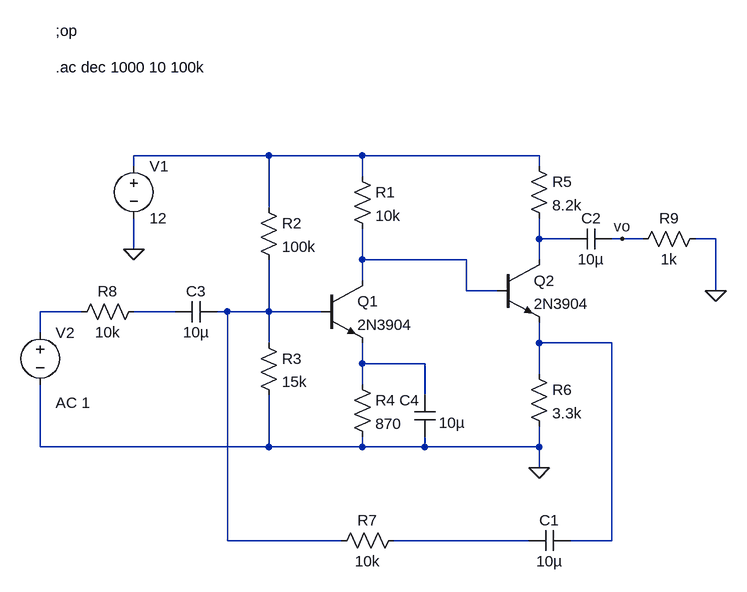
[diagram p0: schematic realimentacion1.asc]
realimentacion1.asc, the LTspice schematic file:
Version 4
SHEET 1 880 708
WIRE -144 16 -352 16
WIRE 0 16 -144 16
WIRE 272 16 0 16
WIRE -352 32 -352 16
WIRE 272 32 272 16
WIRE 0 48 0 16
WIRE -144 96 -144 16
WIRE 272 144 272 112
WIRE 320 144 272 144
WIRE 400 144 384 144
WIRE 432 144 400 144
WIRE 544 144 512 144
WIRE -352 160 -352 112
WIRE 0 176 0 128
WIRE 80 176 0 176
WIRE 160 176 80 176
WIRE 272 176 272 144
WIRE 0 208 0 176
WIRE 160 224 160 176
WIRE 208 224 160 224
WIRE 544 224 544 144
WIRE -432 256 -496 256
WIRE -288 256 -352 256
WIRE -208 256 -224 256
WIRE -144 256 -144 176
WIRE -144 256 -208 256
WIRE -96 256 -144 256
WIRE -64 256 -96 256
WIRE -496 288 -496 256
WIRE -144 304 -144 256
WIRE 272 304 272 272
WIRE 304 304 272 304
WIRE 384 304 304 304
WIRE 0 336 0 304
WIRE 48 336 0 336
WIRE 96 336 48 336
WIRE 272 352 272 304
WIRE 0 368 0 336
WIRE 96 384 96 336
WIRE -496 464 -496 368
WIRE -144 464 -144 384
WIRE -144 464 -496 464
WIRE 0 464 0 448
WIRE 0 464 -144 464
WIRE 96 464 96 448
WIRE 96 464 0 464
WIRE 272 464 272 432
WIRE 272 464 96 464
WIRE 272 496 272 464
WIRE -208 608 -208 256
WIRE -32 608 -208 608
WIRE 256 608 48 608
WIRE 384 608 384 304
WIRE 384 608 320 608
FLAG -352 160 0
FLAG 544 224 0
FLAG 272 496 0
FLAG 400 144 vo
DATAFLAG 272 144 ""
DATAFLAG 304 304 ""
DATAFLAG 80 176 ""
DATAFLAG 48 336 ""
DATAFLAG -96 256 ""
SYMBOL voltage -352 16 R0
WINDOW 123 0 0 Left 2
WINDOW 39 0 0 Left 2
SYMATTR InstName V1
SYMATTR Value 12
SYMBOL npn -64 208 R0
SYMATTR InstName Q1
SYMATTR Value 2N3904
SYMBOL npn 208 176 R0
SYMATTR InstName Q2
SYMATTR Value 2N3904
SYMBOL res -16 32 R0
SYMATTR InstName R1
SYMATTR Value 10k
SYMBOL res -160 80 R0
SYMATTR InstName R2
SYMATTR Value 100k
SYMBOL res -160 288 R0
SYMATTR InstName R3
SYMATTR Value 15k
SYMBOL res -16 352 R0
SYMATTR InstName R4
SYMATTR Value 870
SYMBOL res 256 16 R0
SYMATTR InstName R5
SYMATTR Value 8.2k
SYMBOL res 256 336 R0
SYMATTR InstName R6
SYMATTR Value 3.3k
SYMBOL res 64 592 R90
WINDOW 0 0 56 VBottom 2
WINDOW 3 32 56 VTop 2
SYMATTR InstName R7
SYMATTR Value 10k
SYMBOL res -336 240 R90
WINDOW 0 0 56 VBottom 2
WINDOW 3 32 56 VTop 2
SYMATTR InstName R8
SYMATTR Value 10k
SYMBOL res 528 128 R90
WINDOW 0 0 56 VBottom 2
WINDOW 3 32 56 VTop 2
SYMATTR InstName R9
SYMATTR Value 1k
SYMBOL cap 320 592 R90
WINDOW 0 0 32 VBottom 2
WINDOW 3 32 32 VTop 2
SYMATTR InstName C1
SYMATTR Value 10µ
SYMBOL cap 384 128 R90
WINDOW 0 0 32 VBottom 2
WINDOW 3 32 32 VTop 2
SYMATTR InstName C2
SYMATTR Value 10µ
SYMBOL cap -224 240 R90
WINDOW 0 0 32 VBottom 2
WINDOW 3 32 32 VTop 2
SYMATTR InstName C3
SYMATTR Value 10µ
SYMBOL cap 112 448 R180
WINDOW 0 24 56 Left 2
WINDOW 3 -46 21 Left 2
SYMATTR InstName C4
SYMATTR Value 10µ
SYMBOL voltage -496 272 R0
WINDOW 123 24 124 Left 2
WINDOW 39 0 0 Left 2
SYMATTR Value2 AC 1
SYMATTR InstName V2
SYMATTR Value ""
TEXT -472 -176 Left 2 !;op
TEXT -472 -120 Left 2 !.ac dec 1000 10 100k

The netlist it stands for:
* realimentacion1.asc
V1 N001 0 12
Q1 N003 N006 N008 0 2N3904
Q2 N002 N003 N007 0 2N3904
R1 N001 N003 10k
R2 N001 N006 100k
R3 N006 0 15k
R4 N008 0 870
R5 N001 N002 8.2k
R6 N007 0 3.3k
R7 N009 N006 10k
R8 N005 N004 10k
R9 0 vo 1k
C1 N007 N009 10µ
C2 vo N002 10µ
C3 N006 N005 10µ
C4 0 N008 10µ
V2 N004 0 AC 1
.model NPN NPN
.model PNP PNP
.lib standard.bjt
;op
.ac dec 1000 10 100k
.backanno
.end